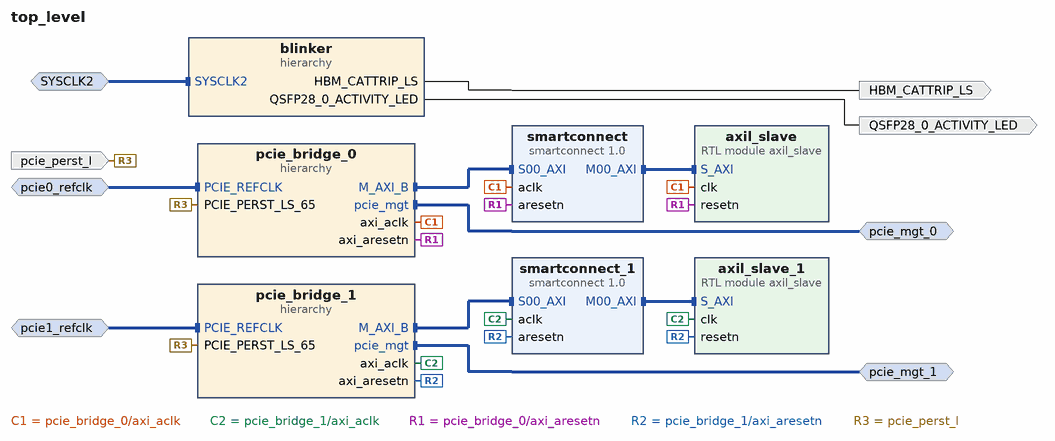
[diagram p0: block diagram of the top level]
# Vivado block design top_level, xcu55c-fsvh2892-2L-e, Vivado 2024.2
create_bd_design top_level

create_bd_intf_port -mode Slave -vlnv xilinx.com:interface:diff_clock_rtl:1.0 pcie0_refclk
create_bd_intf_port -mode Master -vlnv xilinx.com:interface:pcie_7x_mgt_rtl:1.0 pcie_mgt_0
create_bd_intf_port -mode Master -vlnv xilinx.com:interface:pcie_7x_mgt_rtl:1.0 pcie_mgt_1
create_bd_intf_port -mode Slave -vlnv xilinx.com:interface:diff_clock_rtl:1.0 pcie1_refclk
create_bd_intf_port -mode Slave -vlnv xilinx.com:interface:diff_clock_rtl:1.0 SYSCLK2
create_bd_port -dir O QSFP28_0_ACTIVITY_LED
create_bd_port -dir O HBM_CATTRIP_LS
create_bd_port -dir I -type rst pcie_perst_l

create_bd_cell -type hier blinker
create_bd_cell -type ip -vlnv xilinx.com:ip:smartconnect:1.0 smartconnect
set_property -dict {CONFIG.NUM_SI 1} [get_bd_cells smartconnect]
create_bd_cell -type module -reference axil_slave axil_slave
create_bd_cell -type hier pcie_bridge_0
create_bd_cell -type ip -vlnv xilinx.com:ip:smartconnect:1.0 smartconnect_1
set_property -dict {CONFIG.NUM_SI 1} [get_bd_cells smartconnect_1]
create_bd_cell -type module -reference axil_slave axil_slave_1
create_bd_cell -type hier pcie_bridge_1

# ---- hierarchy /blinker ----
current_bd_instance /blinker
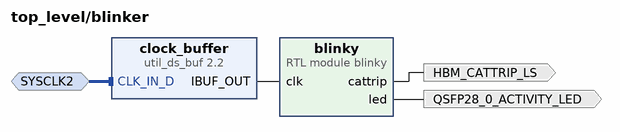
[diagram p1: block diagram inside /blinker]
create_bd_intf_pin -mode Slave -vlnv xilinx.com:interface:diff_clock_rtl:1.0 SYSCLK2
create_bd_pin -dir O HBM_CATTRIP_LS
create_bd_pin -dir O QSFP28_0_ACTIVITY_LED

create_bd_cell -type ip -vlnv xilinx.com:ip:util_ds_buf:2.2 clock_buffer
create_bd_cell -type module -reference blinky blinky

# ---- hierarchy /pcie_bridge_0 ----
current_bd_instance /pcie_bridge_0
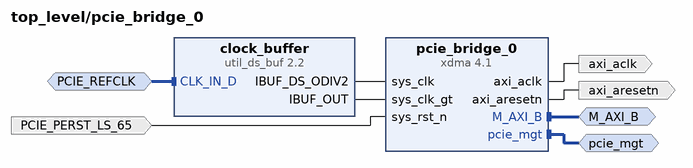
[diagram p2: block diagram inside /pcie_bridge_0]
create_bd_intf_pin -mode Master -vlnv xilinx.com:interface:pcie_7x_mgt_rtl:1.0 pcie_mgt
create_bd_intf_pin -mode Slave -vlnv xilinx.com:interface:diff_clock_rtl:1.0 PCIE_REFCLK
create_bd_intf_pin -mode Master -vlnv xilinx.com:interface:aximm_rtl:1.0 M_AXI_B
create_bd_pin -dir I -type rst PCIE_PERST_LS_65
create_bd_pin -dir O axi_aclk
create_bd_pin -dir O axi_aresetn

create_bd_cell -type ip -vlnv xilinx.com:ip:xdma:4.1 pcie_bridge_0
set_property -dict [list \
  CONFIG.PF0_DEVICE_ID_mqdma 9048 \
  CONFIG.PF0_SRIOV_VF_DEVICE_ID A048 \
  CONFIG.PF2_DEVICE_ID_mqdma 9248 \
  CONFIG.PF3_DEVICE_ID_mqdma 9348 \
  CONFIG.axi_addr_width 64 \
  CONFIG.axi_data_width 512_bit \
  CONFIG.axisten_freq 250 \
  CONFIG.bridge_burst true \
  CONFIG.en_axi_slave_if false \
  CONFIG.en_gt_selection false \
  CONFIG.functional_mode AXI_Bridge \
  CONFIG.mode_selection Advanced \
  CONFIG.pcie_blk_locn PCIE4C_X1Y1 \
  CONFIG.pf0_bar0_scale Megabytes \
  CONFIG.pf0_bar0_size 1 \
  CONFIG.pf0_device_id 903f \
  CONFIG.pf0_msi_enabled false \
  CONFIG.pl_link_cap_max_link_speed 16.0_GT/s \
  CONFIG.pl_link_cap_max_link_width X8 \
  CONFIG.runbit_fix false \
  CONFIG.xlnx_ref_board None \
] [get_bd_cells pcie_bridge_0]
create_bd_cell -type ip -vlnv xilinx.com:ip:util_ds_buf:2.2 clock_buffer
set_property -dict {CONFIG.C_BUF_TYPE IBUFDSGTE} [get_bd_cells clock_buffer]

# ---- hierarchy /pcie_bridge_1 ----
current_bd_instance /pcie_bridge_1
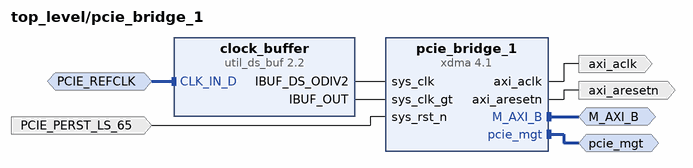
[diagram p3: block diagram inside /pcie_bridge_1]
create_bd_intf_pin -mode Master -vlnv xilinx.com:interface:pcie_7x_mgt_rtl:1.0 pcie_mgt
create_bd_intf_pin -mode Slave -vlnv xilinx.com:interface:diff_clock_rtl:1.0 PCIE_REFCLK
create_bd_intf_pin -mode Master -vlnv xilinx.com:interface:aximm_rtl:1.0 M_AXI_B
create_bd_pin -dir I -type rst PCIE_PERST_LS_65
create_bd_pin -dir O axi_aclk
create_bd_pin -dir O axi_aresetn

create_bd_cell -type ip -vlnv xilinx.com:ip:xdma:4.1 pcie_bridge_1
set_property -dict [list \
  CONFIG.PCIE_BOARD_INTERFACE Custom \
  CONFIG.PF0_DEVICE_ID_mqdma 9048 \
  CONFIG.PF0_SRIOV_VF_DEVICE_ID A048 \
  CONFIG.PF2_DEVICE_ID_mqdma 9248 \
  CONFIG.PF3_DEVICE_ID_mqdma 9348 \
  CONFIG.SYS_RST_N_BOARD_INTERFACE Custom \
  CONFIG.axi_addr_width 64 \
  CONFIG.axi_data_width 512_bit \
  CONFIG.axisten_freq 250 \
  CONFIG.bridge_burst true \
  CONFIG.en_axi_slave_if false \
  CONFIG.en_gt_selection true \
  CONFIG.functional_mode AXI_Bridge \
  CONFIG.mode_selection Advanced \
  CONFIG.pcie_blk_locn PCIE4C_X1Y0 \
  CONFIG.pf0_bar0_scale Megabytes \
  CONFIG.pf0_bar0_size 1 \
  CONFIG.pf0_device_id 9040 \
  CONFIG.pf0_msi_enabled false \
  CONFIG.pl_link_cap_max_link_speed 16.0_GT/s \
  CONFIG.pl_link_cap_max_link_width X8 \
  CONFIG.runbit_fix false \
  CONFIG.select_quad GTY_Quad_225 \
  CONFIG.xlnx_ref_board None \
] [get_bd_cells pcie_bridge_1]
create_bd_cell -type ip -vlnv xilinx.com:ip:util_ds_buf:2.2 clock_buffer
set_property -dict {CONFIG.C_BUF_TYPE IBUFDSGTE} [get_bd_cells clock_buffer]

# ---- connections ----

current_bd_instance /blinker
connect_bd_intf_net [get_bd_intf_pins SYSCLK2] [get_bd_intf_pins clock_buffer/CLK_IN_D]
connect_bd_net [get_bd_pins blinky/cattrip] [get_bd_pins HBM_CATTRIP_LS]
connect_bd_net [get_bd_pins blinky/led] [get_bd_pins QSFP28_0_ACTIVITY_LED]
connect_bd_net -net util_ds_buf_1_IBUF_OUT [get_bd_pins clock_buffer/IBUF_OUT] [get_bd_pins blinky/clk]

current_bd_instance /pcie_bridge_0
connect_bd_intf_net [get_bd_intf_pins PCIE_REFCLK] [get_bd_intf_pins clock_buffer/CLK_IN_D]
connect_bd_intf_net [get_bd_intf_pins M_AXI_B] [get_bd_intf_pins pcie_bridge_0/M_AXI_B]
connect_bd_intf_net [get_bd_intf_pins pcie_mgt] [get_bd_intf_pins pcie_bridge_0/pcie_mgt]
connect_bd_net -net sys_rst_n_0_1 [get_bd_pins PCIE_PERST_LS_65] [get_bd_pins pcie_bridge_0/sys_rst_n]
connect_bd_net -net util_ds_buf_0_IBUF_DS_ODIV2 [get_bd_pins clock_buffer/IBUF_DS_ODIV2] [get_bd_pins pcie_bridge_0/sys_clk]
connect_bd_net -net util_ds_buf_0_IBUF_OUT [get_bd_pins clock_buffer/IBUF_OUT] [get_bd_pins pcie_bridge_0/sys_clk_gt]
connect_bd_net -net xdma_0_axi_aclk [get_bd_pins pcie_bridge_0/axi_aclk] [get_bd_pins axi_aclk]
connect_bd_net -net xdma_0_axi_aresetn [get_bd_pins pcie_bridge_0/axi_aresetn] [get_bd_pins axi_aresetn]

current_bd_instance /pcie_bridge_1
connect_bd_intf_net [get_bd_intf_pins PCIE_REFCLK] [get_bd_intf_pins clock_buffer/CLK_IN_D]
connect_bd_intf_net [get_bd_intf_pins M_AXI_B] [get_bd_intf_pins pcie_bridge_1/M_AXI_B]
connect_bd_intf_net [get_bd_intf_pins pcie_mgt] [get_bd_intf_pins pcie_bridge_1/pcie_mgt]
connect_bd_net -net sys_rst_n_0_1 [get_bd_pins PCIE_PERST_LS_65] [get_bd_pins pcie_bridge_1/sys_rst_n]
connect_bd_net -net util_ds_buf_0_IBUF_DS_ODIV2 [get_bd_pins clock_buffer/IBUF_DS_ODIV2] [get_bd_pins pcie_bridge_1/sys_clk]
connect_bd_net -net util_ds_buf_0_IBUF_OUT [get_bd_pins clock_buffer/IBUF_OUT] [get_bd_pins pcie_bridge_1/sys_clk_gt]
connect_bd_net -net xdma_0_axi_aclk [get_bd_pins pcie_bridge_1/axi_aclk] [get_bd_pins axi_aclk]
connect_bd_net -net xdma_0_axi_aresetn [get_bd_pins pcie_bridge_1/axi_aresetn] [get_bd_pins axi_aresetn]

current_bd_instance /
connect_bd_intf_net [get_bd_intf_ports pcie0_refclk] [get_bd_intf_pins pcie_bridge_0/PCIE_REFCLK]
connect_bd_intf_net [get_bd_intf_ports pcie1_refclk] [get_bd_intf_pins pcie_bridge_1/PCIE_REFCLK]
connect_bd_intf_net [get_bd_intf_ports SYSCLK2] [get_bd_intf_pins blinker/SYSCLK2]
connect_bd_intf_net [get_bd_intf_ports pcie_mgt_1] [get_bd_intf_pins pcie_bridge_1/pcie_mgt]
connect_bd_intf_net [get_bd_intf_pins pcie_bridge_0/M_AXI_B] [get_bd_intf_pins smartconnect/S00_AXI]
connect_bd_intf_net [get_bd_intf_pins pcie_bridge_1/M_AXI_B] [get_bd_intf_pins smartconnect_1/S00_AXI]
connect_bd_intf_net [get_bd_intf_pins axil_slave/S_AXI] [get_bd_intf_pins smartconnect/M00_AXI]
connect_bd_intf_net [get_bd_intf_pins axil_slave_1/S_AXI] [get_bd_intf_pins smartconnect_1/M00_AXI]
connect_bd_intf_net [get_bd_intf_ports pcie_mgt_0] [get_bd_intf_pins pcie_bridge_0/pcie_mgt]
connect_bd_net -net blinky_cattrip [get_bd_pins blinker/HBM_CATTRIP_LS] [get_bd_ports HBM_CATTRIP_LS]
connect_bd_net -net blinky_led [get_bd_pins blinker/QSFP28_0_ACTIVITY_LED] [get_bd_ports QSFP28_0_ACTIVITY_LED]
connect_bd_net [get_bd_pins pcie_bridge_0/axi_aclk] [get_bd_pins smartconnect/aclk] [get_bd_pins axil_slave/clk]
connect_bd_net -net pcie_bridge_0_axi_aclk_1 [get_bd_pins pcie_bridge_1/axi_aclk] [get_bd_pins smartconnect_1/aclk] [get_bd_pins axil_slave_1/clk]
connect_bd_net [get_bd_pins pcie_bridge_0/axi_aresetn] [get_bd_pins smartconnect/aresetn] [get_bd_pins axil_slave/resetn]
connect_bd_net -net pcie_bridge_0_axi_aresetn_1 [get_bd_pins pcie_bridge_1/axi_aresetn] \
  [get_bd_pins smartconnect_1/aresetn] [get_bd_pins axil_slave_1/resetn]
connect_bd_net -net sys_rst_n_0_1 [get_bd_ports pcie_perst_l] \
  [get_bd_pins pcie_bridge_0/PCIE_PERST_LS_65] [get_bd_pins pcie_bridge_1/PCIE_PERST_LS_65]

# ---- address map ----
assign_bd_address -offset 0x0000000000001000 -range 256 -target_address_space [get_bd_addr_spaces pcie_bridge_0/pcie_bridge_0/M_AXI_B] [get_bd_addr_segs axil_slave/S_AXI/reg0]
assign_bd_address -offset 0x0000000000001000 -range 256 -target_address_space [get_bd_addr_spaces pcie_bridge_1/pcie_bridge_1/M_AXI_B] [get_bd_addr_segs axil_slave_1/S_AXI/reg0]

validate_bd_design
save_bd_design
